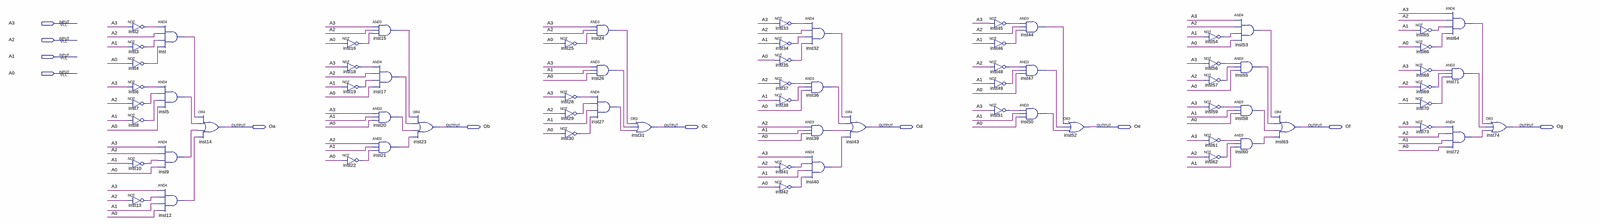
[diagram p0: schematic sheet, whole]
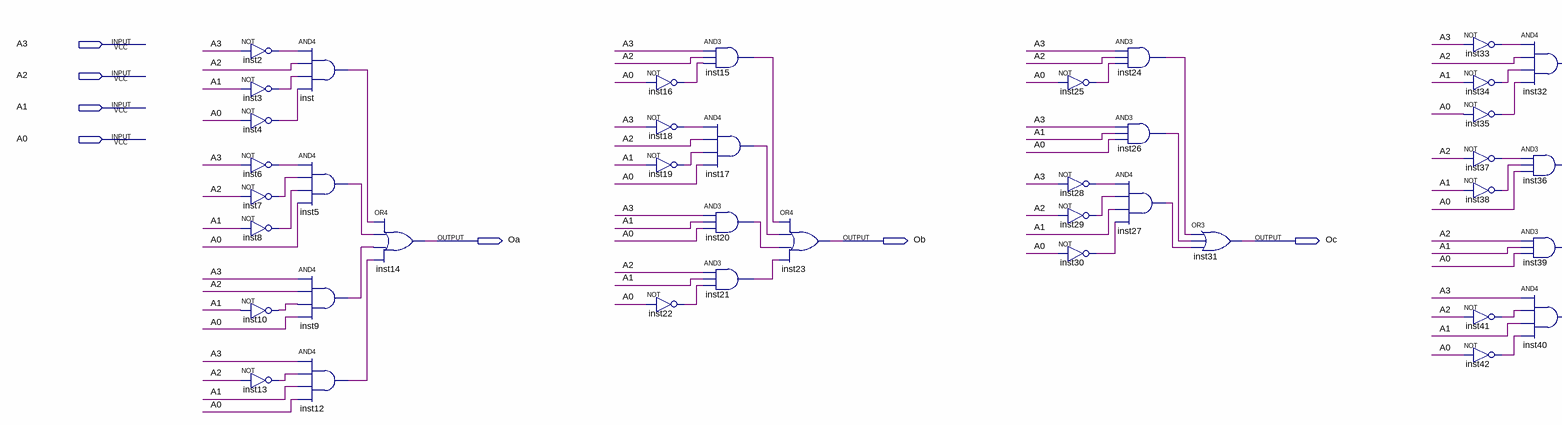
[diagram p1: schematic sheet, left part]
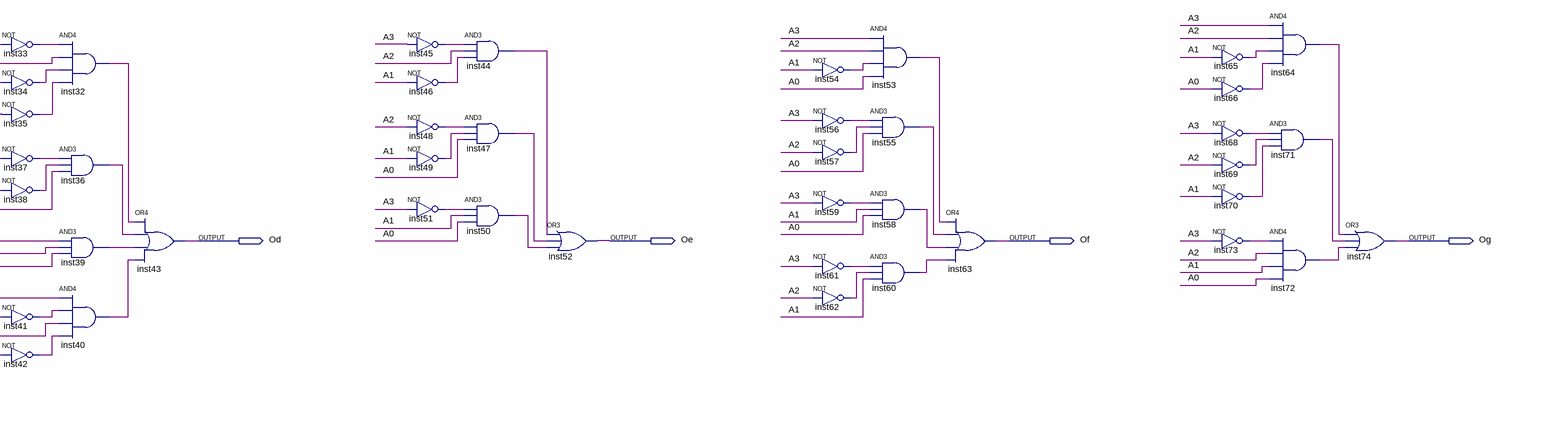
[diagram p2: schematic sheet, right part]
// Quartus schematic hex.bdf as structural Verilog: 72 symbols, 11 pins
module hex (
  input  A3,
  input  A2,
  input  A1,
  input  A0,
  output Oa,
  output Ob,
  output Oc,
  output Od,
  output Oe,
  output Of,
  output Og
);

  wire inst2_out, inst3_out, inst4_out, inst5_out, inst6_out, inst7_out, inst8_out, inst9_out, inst10_out,
       inst12_out, inst13_out, inst15_out, inst16_out, inst17_out, inst18_out, inst19_out, inst20_out,
       inst21_out, inst22_out, inst24_out, inst25_out, inst26_out, inst27_out, inst28_out, inst29_out,
       inst30_out, inst32_out, inst33_out, inst34_out, inst35_out, inst36_out, inst37_out, inst38_out,
       inst39_out, inst40_out, inst41_out, inst42_out, inst44_out, inst45_out, inst46_out, inst47_out,
       inst48_out, inst49_out, inst50_out, inst51_out, inst53_out, inst54_out, inst55_out, inst56_out,
       inst57_out, inst58_out, inst59_out, inst60_out, inst61_out, inst62_out, inst64_out, inst65_out,
       inst66_out, inst68_out, inst69_out, inst70_out, inst71_out, inst72_out, inst73_out, inst_out;

  not inst2 (inst2_out, A3);
  not inst3 (inst3_out, A1);
  not inst4 (inst4_out, A0);
  not inst6 (inst6_out, A3);
  not inst7 (inst7_out, A2);
  not inst8 (inst8_out, A1);
  not inst10 (inst10_out, A1);
  not inst13 (inst13_out, A2);
  and inst (inst_out, inst2_out, A2, inst3_out, inst4_out);
  and inst5 (inst5_out, inst6_out, inst7_out, inst8_out, A0);
  and inst9 (inst9_out, A3, A2, inst10_out, A0);
  and inst12 (inst12_out, A3, inst13_out, A1, A0);
  or inst14 (Oa, inst_out, inst5_out, inst9_out, inst12_out);
  not inst16 (inst16_out, A0);
  not inst18 (inst18_out, A3);
  not inst19 (inst19_out, A1);
  not inst22 (inst22_out, A0);
  and inst15 (inst15_out, A3, A2, inst16_out);
  and inst17 (inst17_out, inst18_out, A2, inst19_out, A0);
  and inst20 (inst20_out, A3, A1, A0);
  and inst21 (inst21_out, A2, A1, inst22_out);
  or inst23 (Ob, inst15_out, inst17_out, inst20_out, inst21_out);
  not inst25 (inst25_out, A0);
  not inst28 (inst28_out, A3);
  not inst29 (inst29_out, A2);
  not inst30 (inst30_out, A0);
  and inst24 (inst24_out, A3, A2, inst25_out);
  and inst26 (inst26_out, A3, A1, A0);
  and inst27 (inst27_out, inst28_out, inst29_out, A1, inst30_out);
  or inst31 (Oc, inst24_out, inst26_out, inst27_out);
  not inst33 (inst33_out, A3);
  not inst34 (inst34_out, A1);
  not inst35 (inst35_out, A0);
  not inst37 (inst37_out, A2);
  not inst38 (inst38_out, A1);
  not inst41 (inst41_out, A2);
  not inst42 (inst42_out, A0);
  and inst32 (inst32_out, inst33_out, A2, inst34_out, inst35_out);
  and inst36 (inst36_out, inst37_out, inst38_out, A0);
  and inst39 (inst39_out, A2, A1, A0);
  and inst40 (inst40_out, A3, inst41_out, A1, inst42_out);
  or inst43 (Od, inst32_out, inst36_out, inst39_out, inst40_out);
  not inst45 (inst45_out, A3);
  not inst46 (inst46_out, A1);
  not inst48 (inst48_out, A2);
  not inst49 (inst49_out, A1);
  not inst51 (inst51_out, A3);
  and inst44 (inst44_out, inst45_out, A2, inst46_out);
  and inst47 (inst47_out, inst48_out, inst49_out, A0);
  and inst50 (inst50_out, inst51_out, A1, A0);
  or inst52 (Oe, inst44_out, inst47_out, inst50_out);
  not inst54 (inst54_out, A1);
  not inst56 (inst56_out, A3);
  not inst57 (inst57_out, A2);
  not inst59 (inst59_out, A3);
  not inst61 (inst61_out, A3);
  not inst62 (inst62_out, A2);
  and inst53 (inst53_out, A3, A2, inst54_out, A0);
  and inst55 (inst55_out, inst56_out, inst57_out, A0);
  and inst58 (inst58_out, inst59_out, A1, A0);
  and inst60 (inst60_out, inst61_out, inst62_out, A1);
  or inst63 (Of, inst53_out, inst55_out, inst58_out, inst60_out);
  not inst65 (inst65_out, A1);
  not inst66 (inst66_out, A0);
  not inst68 (inst68_out, A3);
  not inst69 (inst69_out, A2);
  not inst70 (inst70_out, A1);
  not inst73 (inst73_out, A3);
  and inst64 (inst64_out, A3, A2, inst65_out, inst66_out);
  and inst71 (inst71_out, inst68_out, inst69_out, inst70_out);
  and inst72 (inst72_out, inst73_out, A2, A1, A0);
  or inst74 (Og, inst64_out, inst71_out, inst72_out);
endmodule
